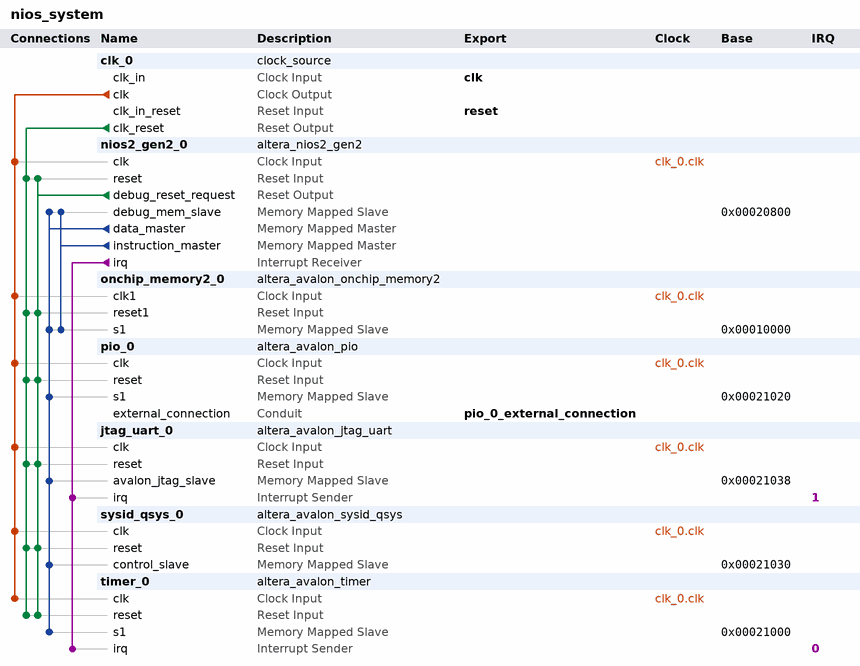
[diagram p0: system contents]
# Platform Designer (Qsys) system nios_system, Cyclone IV E EP4CE10E22A7
# Parameters at their usual value, and those the tool derives, are not listed.
package require -exact qsys 18.1
create_system nios_system
set_project_property DEVICE_FAMILY {Cyclone IV E}
set_project_property DEVICE EP4CE10E22A7

add_instance clk_0 clock_source 18.1
set_instance_parameter_value clk_0 clockFrequency 50000000

add_instance nios2_gen2_0 altera_nios2_gen2 18.1
set_instance_parameter_value nios2_gen2_0 dcache_size 2048
set_instance_parameter_value nios2_gen2_0 exceptionSlave onchip_memory2_0.s1
set_instance_parameter_value nios2_gen2_0 icache_size 4096
set_instance_parameter_value nios2_gen2_0 impl Tiny
set_instance_parameter_value nios2_gen2_0 resetSlave onchip_memory2_0.s1

add_instance onchip_memory2_0 altera_avalon_onchip_memory2 18.1
set_instance_parameter_value onchip_memory2_0 dataWidth 32
set_instance_parameter_value onchip_memory2_0 dualPort false
set_instance_parameter_value onchip_memory2_0 initMemContent true
set_instance_parameter_value onchip_memory2_0 initializationFileName onchip_mem.hex
set_instance_parameter_value onchip_memory2_0 memorySize 49152

add_instance pio_0 altera_avalon_pio 18.1
set_instance_parameter_value pio_0 direction Output
set_instance_parameter_value pio_0 width 8

add_instance jtag_uart_0 altera_avalon_jtag_uart 18.1
set_instance_parameter_value jtag_uart_0 simInteractiveOptions NO_INTERACTIVE_WINDOWS

add_instance sysid_qsys_0 altera_avalon_sysid_qsys 18.1
set_instance_parameter_value sysid_qsys_0 id 0

add_instance timer_0 altera_avalon_timer 18.1
set_instance_parameter_value timer_0 period 1
set_instance_parameter_value timer_0 periodUnits MSEC

# connections
add_connection clk_0.clk jtag_uart_0.clk clock
add_connection clk_0.clk nios2_gen2_0.clk clock
add_connection clk_0.clk onchip_memory2_0.clk1 clock
add_connection clk_0.clk pio_0.clk clock
add_connection clk_0.clk sysid_qsys_0.clk clock
add_connection clk_0.clk timer_0.clk clock
add_connection clk_0.clk_reset jtag_uart_0.reset reset
add_connection clk_0.clk_reset nios2_gen2_0.reset reset
add_connection clk_0.clk_reset onchip_memory2_0.reset1 reset
add_connection clk_0.clk_reset pio_0.reset reset
add_connection clk_0.clk_reset sysid_qsys_0.reset reset
add_connection clk_0.clk_reset timer_0.reset reset
add_connection nios2_gen2_0.debug_reset_request jtag_uart_0.reset reset
add_connection nios2_gen2_0.debug_reset_request nios2_gen2_0.reset reset
add_connection nios2_gen2_0.debug_reset_request onchip_memory2_0.reset1 reset
add_connection nios2_gen2_0.debug_reset_request pio_0.reset reset
add_connection nios2_gen2_0.debug_reset_request sysid_qsys_0.reset reset
add_connection nios2_gen2_0.debug_reset_request timer_0.reset reset
add_connection nios2_gen2_0.data_master jtag_uart_0.avalon_jtag_slave avalon
set_connection_parameter_value nios2_gen2_0.data_master/jtag_uart_0.avalon_jtag_slave baseAddress 0x00021038
add_connection nios2_gen2_0.data_master nios2_gen2_0.debug_mem_slave avalon
set_connection_parameter_value nios2_gen2_0.data_master/nios2_gen2_0.debug_mem_slave baseAddress 0x00020800
add_connection nios2_gen2_0.data_master onchip_memory2_0.s1 avalon
set_connection_parameter_value nios2_gen2_0.data_master/onchip_memory2_0.s1 baseAddress 0x00010000
add_connection nios2_gen2_0.data_master pio_0.s1 avalon
set_connection_parameter_value nios2_gen2_0.data_master/pio_0.s1 baseAddress 0x00021020
add_connection nios2_gen2_0.data_master sysid_qsys_0.control_slave avalon
set_connection_parameter_value nios2_gen2_0.data_master/sysid_qsys_0.control_slave baseAddress 0x00021030
add_connection nios2_gen2_0.data_master timer_0.s1 avalon
set_connection_parameter_value nios2_gen2_0.data_master/timer_0.s1 baseAddress 0x00021000
add_connection nios2_gen2_0.instruction_master nios2_gen2_0.debug_mem_slave avalon
set_connection_parameter_value nios2_gen2_0.instruction_master/nios2_gen2_0.debug_mem_slave baseAddress 0x00020800
add_connection nios2_gen2_0.instruction_master onchip_memory2_0.s1 avalon
set_connection_parameter_value nios2_gen2_0.instruction_master/onchip_memory2_0.s1 baseAddress 0x00010000
add_connection nios2_gen2_0.irq jtag_uart_0.irq interrupt
set_connection_parameter_value nios2_gen2_0.irq/jtag_uart_0.irq irqNumber 1
add_connection nios2_gen2_0.irq timer_0.irq interrupt
set_connection_parameter_value nios2_gen2_0.irq/timer_0.irq irqNumber 0

# exported interfaces
add_interface clk clock sink
set_interface_property clk EXPORT_OF clk_0.clk_in
add_interface pio_0_external_connection conduit end
set_interface_property pio_0_external_connection EXPORT_OF pio_0.external_connection
add_interface reset reset sink
set_interface_property reset EXPORT_OF clk_0.clk_in_reset

set_interconnect_requirement {$system} qsys_mm.clockCrossingAdapter HANDSHAKE
set_interconnect_requirement {$system} qsys_mm.enableEccProtection FALSE
set_interconnect_requirement {$system} qsys_mm.insertDefaultSlave FALSE
set_interconnect_requirement {$system} qsys_mm.maxAdditionalLatency 1

save_system nios_system.qsys
